# EAGLE design nisetoro_wsc_adapter_v3 (EAGLE 9.6.2)
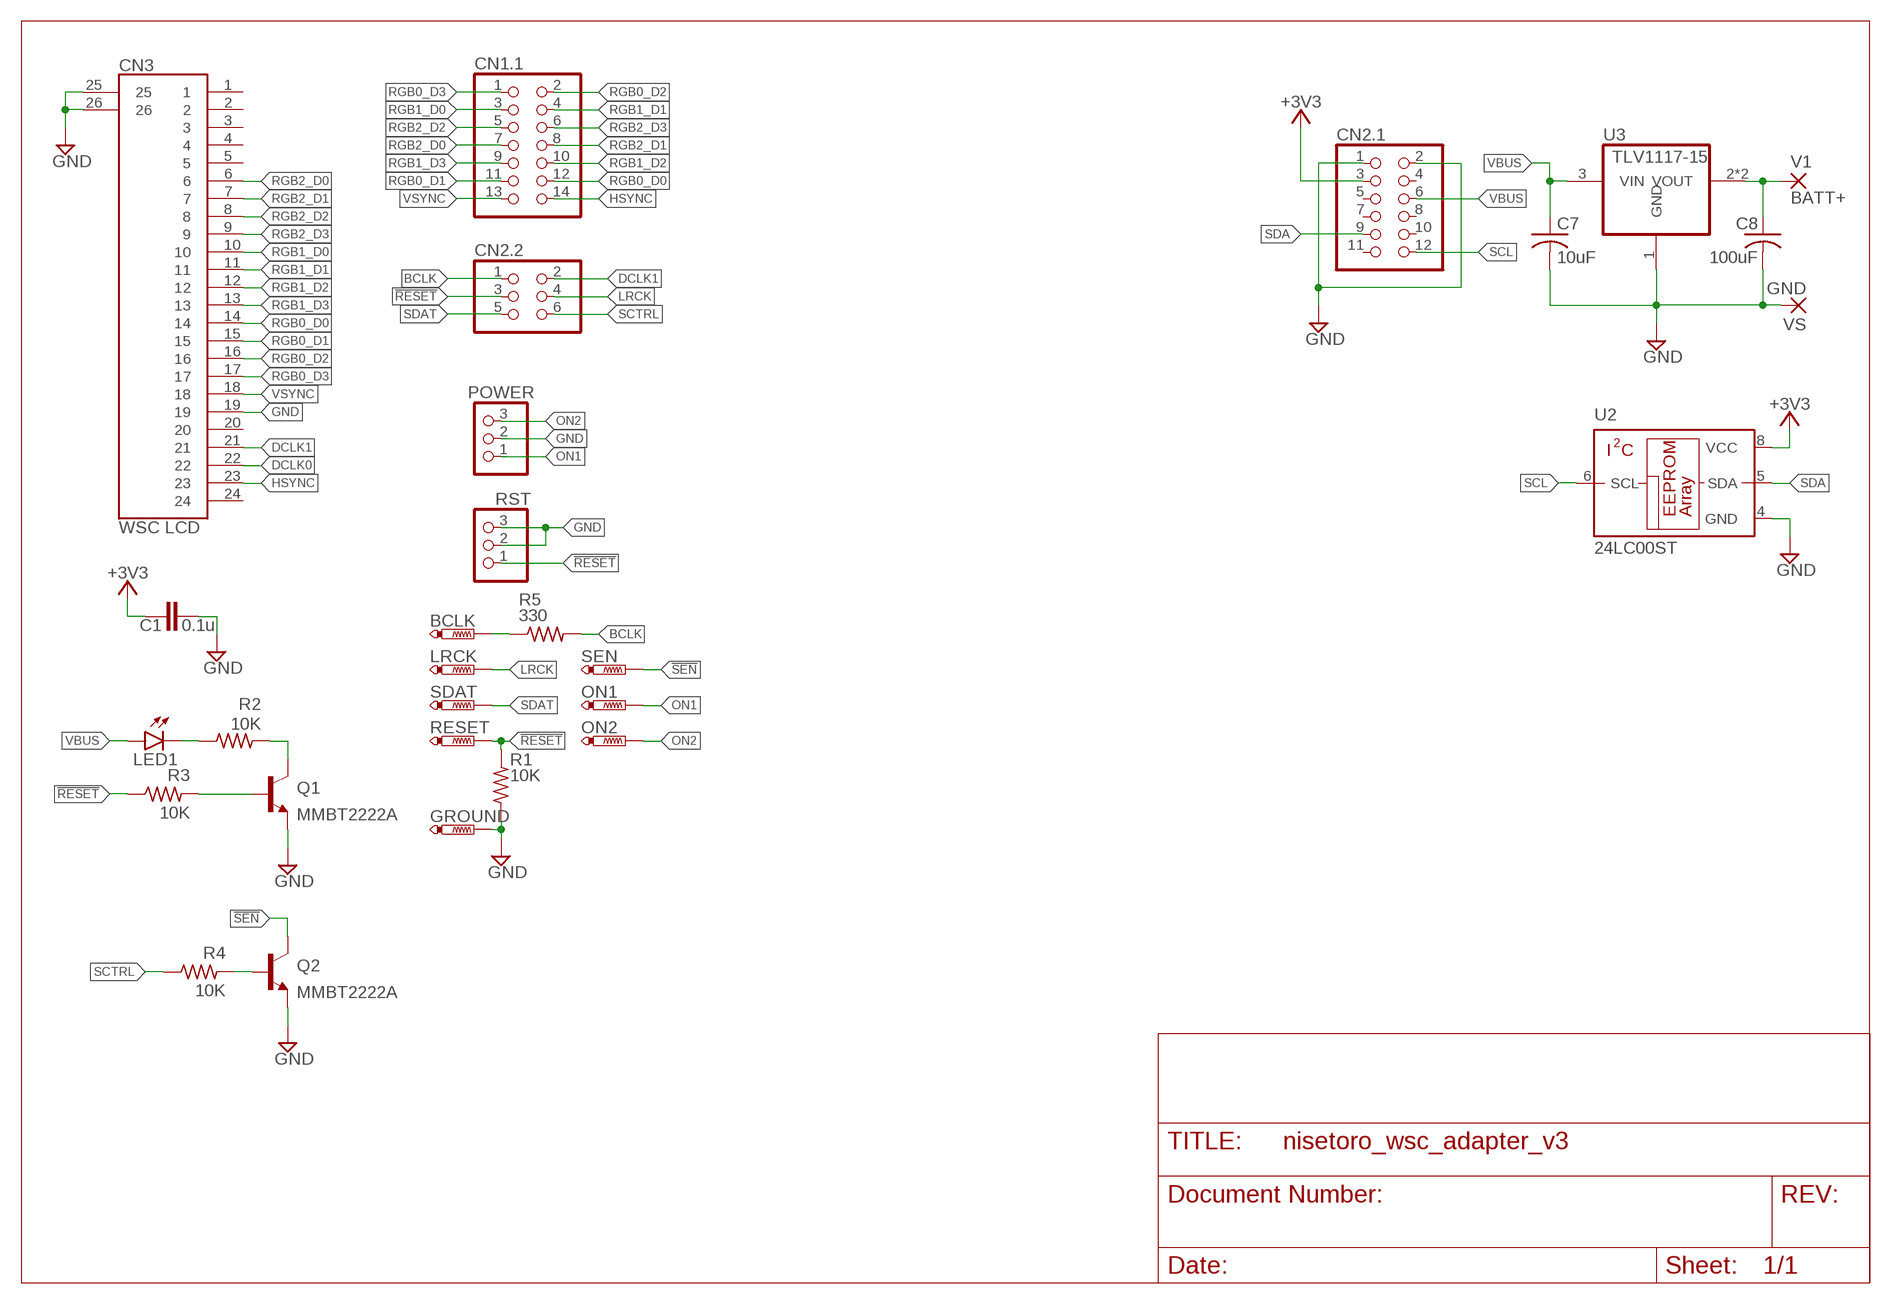
[diagram p0: schematic, sheet 1]

## Parts
BCLK  PTR1B1,27  [B1,27]
C1  0.1u  C-EUC0805  [C0805]
C7  10uF  C-USC1210  [C1210]
C8  100uF  C-USC1210  [C1210]
CN1.1  PINHD-2X7  [2X07]
CN2.1  PINHD-2X6  [2X06]
CN2.2  PINHD-2X3  [2X03]
CN3  WSC LCD  68712414022/R  [68712414022/R]
GROUND  PTR1B1,27  [B1,27]
LED1  LEDSML0603  [SML0603]
LRCK  PTR1B1,27  [B1,27]
ON1  PTR1B1,27  [B1,27]
ON2  PTR1B1,27  [B1,27]
POWER  PINHD-1X3/ROUND  [1X03/ROUND]
Q1  MMBT2222A  2N2222SOT23  [SOT23-BEC]
Q2  MMBT2222A  2N2222SOT23  [SOT23-BEC]
R1  10K  R-US_R0805  [R0805]
R2  10K  R-US_R0805  [R0805]
R3  10K  R-US_R0805  [R0805]
R4  10K  R-US_R0805  [R0805]
R5  330  R-US_R0805  [R0805]
RESET  PTR1B1,27  [B1,27]
RST  PINHD-1X3/ROUND  [1X03/ROUND]
SDAT  PTR1B1,27  [B1,27]
SEN  PTR1B1,27  [B1,27]
U2  24LC00ST  [TSSOP8]
U3  TLV1117-15  REG1117  [SOT223]
V1  BATT+  WIREPADSMD2,54-5,08  [SMD2,54-5,08]
VS  GND  WIREPADSMD2,54-5,08  [SMD2,54-5,08]

## Nets
!RESET: CN2.2.3 R1.2 R3.1 RESET.TP RST.1
!SEN: Q2.C SEN.TP
+3V3: C1.1 CN2.1.3 U2.8(VCC)
BATT+: C8.1 U3.2(VOUT) U3.4(VOUT) V1.1(P)
BCLK: CN2.2.1 R5.2
DCLK0: CN3.22
DCLK1: CN2.2.2 CN3.21
GND: C1.2 C7.2 C8.2 CN2.1.1 CN2.1.2 CN3.19 CN3.25 CN3.26 GROUND.TP POWER.2 Q1.E Q2.E R1.1 RST.2 RST.3 U2.4(GND) U3.1(GND) VS.1(P)
HSYNC: CN1.1.14 CN3.23
LRCK: CN2.2.4 LRCK.TP
N$1: LED1.C R2.1
N$2: Q1.C R2.2
N$3: BCLK.TP R5.1
N$4: Q1.B R3.2
N$6: Q2.B R4.2
ON1: ON1.TP POWER.1
ON2: ON2.TP POWER.3
RGB0_D0: CN1.1.12 CN3.14
RGB0_D1: CN1.1.11 CN3.15
RGB0_D2: CN1.1.2 CN3.16
RGB0_D3: CN1.1.1 CN3.17
RGB1_D0: CN1.1.3 CN3.10
RGB1_D1: CN1.1.4 CN3.11
RGB1_D2: CN1.1.10 CN3.12
RGB1_D3: CN1.1.9 CN3.13
RGB2_D0: CN1.1.7 CN3.6
RGB2_D1: CN1.1.8 CN3.7
RGB2_D2: CN1.1.5 CN3.8
RGB2_D3: CN1.1.6 CN3.9
SCL: CN2.1.12 U2.6(SCL)
SCTRL: CN2.2.6 R4.1
SDA: CN2.1.9 U2.5(SDA)
SDAT: CN2.2.5 SDAT.TP
VBUS: C7.1 CN2.1.6 LED1.A U3.3(VIN)
VSYNC: CN1.1.13 CN3.18
Unconnected: CN2.1.4 CN2.1.5 CN2.1.7 CN2.1.8 CN2.1.10 CN2.1.11 CN3.1 CN3.2 CN3.3 CN3.4 CN3.5 CN3.20 CN3.24

## Library data of the parts
BCLK GROUND LRCK ON1 ON2 RESET SDAT SEN = testpad:PTR1: TEST PIN
C1 = rcl:C-EU: CAPACITOR, European symbol; SPICEPREFIX: C
C7 C8 = rcl:C-US: CAPACITOR, American symbol; SPICEPREFIX: C
CN1.1 = pinhead:PINHD-2X7: PIN HEADER
CN2.1 = pinhead:PINHD-2X6: PIN HEADER
CN2.2 = pinhead:PINHD-2X3: PIN HEADER
CN3 = SamacSys_Parts:68712414022: Wurth Elektronik 687 0.5mm Pitch 24 Way Straight SMT FPC Connector Source: Datasheet <http://katalog.we-online.de/em/datasheet/68712414022.pdf>
LED1 = led:LED: LED OSRAM: - CHIPLED LG R971, LG N971, LY N971, LG Q971, LY Q971, LO R971, LY R971 LH N974, LH R974 LS Q976, LO Q976, LY Q976 LO Q996 - Hyper CHIPLED LW Q18S LB Q993, LB Q99A, LB R99A - SideLED LS A670, LO A670, LY A670, LG A670, LP A670 LB A673, LV A673, LT A673, LW A673 LH A674 LY A675 LS A676, LA A676, LO A676, LY A676, LW A676 LS A679, LY A679, LG A679 - Hyper Micro SIDELED® LS Y876, LA Y876, LO Y876, LY Y876 LT Y87S - SmartLED LW L88C, LW L88S LB L89C, LB L89S, LG L890 LS L89K, LO L89K, LY L89K LS L896, LA L896, LO L896, LY L896 - TOPLED LS T670, LO T670, LY T670, LG T670, LP T670 LSG T670, LSP T670, LSY T670, LOP T670, LYG T670 LG T671, LOG T671, LSG T671 LB T673, LV T673, LT T673, LW T673 LH T674 LS T676, LA T676, LO T676, LY T676, LB T676, LH T676, LSB T676, LW T676 LB T67C, LV T67C, LT T67C, LS T67K, LO T67K, LY T67K, LW E67C LS E67B, LA E67B, LO E67B, LY E67B, LB E67C, LV E67C, LT E67C LW T67C LS T679, LY T679, LG T679 LS T770, LO T770, LY T770, LG T770, LP T770 LB T773, LV T773, LT T773, LW T773 LH T774 LS E675, LA E675, LY E675, LS T675 LS T776, LA T776, LO T776, LY T776, LB T776 LHGB T686 LT T68C, LB T68C - Hyper Mini TOPLED® LB M676 - Mini TOPLED Santana® LG M470 LS M47K, LO M47K, LY M47K Source: http://www.osram.convergy.de LUXEON: - LUMILED® LXK2-PW12-R00, LXK2-PW12-S00, LXK2-PW14-U00, LXK2-PW14-V00 LXK2-PM12-R00, LXK2-PM12-S00, LXK2-PM14-U00 LXK2-PE12-Q00, LXK2-PE12-R00, LXK2-PE12-S00, LXK2-PE14-T00, LXK2-PE14-U00 LXK2-PB12-K00, LXK2-PB12-L00, LXK2-PB12-M00, LXK2-PB14-N00, LXK2-PB14-P00, LXK2-PB14-Q00 LXK2-PR12-L00, LXK2-PR12-M00, LXK2-PR14-Q00, LXK2-PR14-R00 LXK2-PD12-Q00, LXK2-PD12-R00, LXK2-PD12-S00 LXK2-PH12-R00, LXK2-PH12-S00 LXK2-PL12-P00, LXK2-PL12-Q00, LXK2-PL12-R00 Source: www.luxeon.com KINGBRIGHT: KA-3528ASYC Source: www.kingbright.com
POWER RST = pinhead:PINHD-1X3: PIN HEADER
Q1 Q2 = transistor-npn:2N2222*: NPN Transistor
R1-R5 = rcl:R-US_: RESISTOR, American symbol; SPICEPREFIX: R
U2 = microchip:24*00: Serial EEPROM 128 bit, I2C (AA = 1.8 V/LC = 2.5 V/C = 5.0 V); MF: MICROCHIP; MPN: 24LC00-I/ST; OC_FARNELL: unknown; OC_NEWARK: 96K4067
U3 = burr-brown:REG1117: 800mA and 1A Low Dropout (LDO) Positive Regulator 1.8V, 2.5V, 2.85V, 3.3V, 5V, and Adj; MPN: REG1117; OC_FARNELL: 1097566; OC_NEWARK: 14P6981
V1 VS = wirepad:WIREPAD: Wire PAD connect wire on PCB

## Board
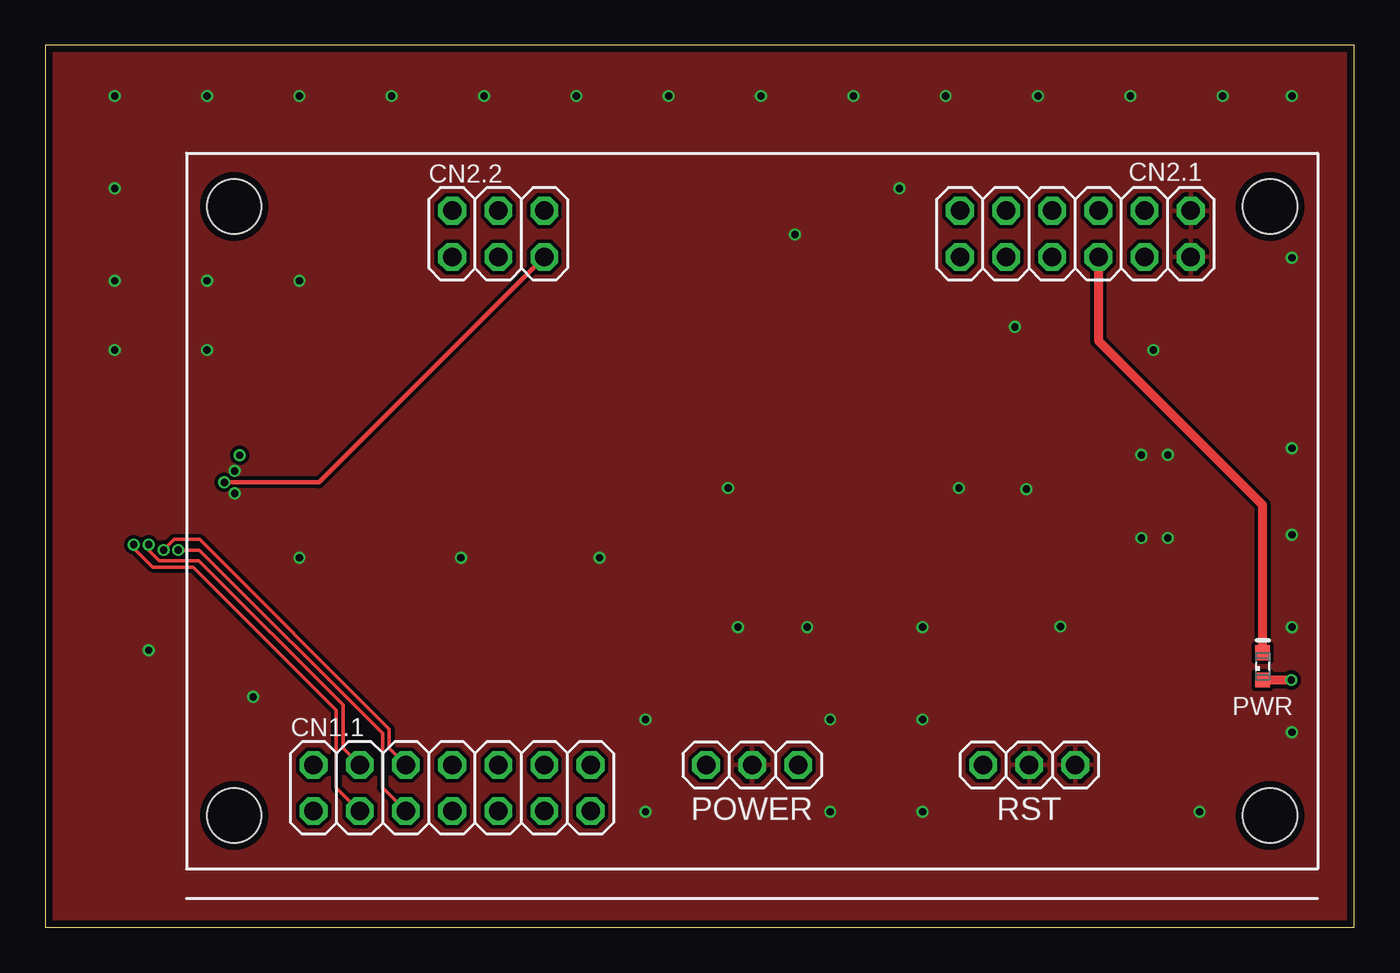
[diagram p1: board, top side]
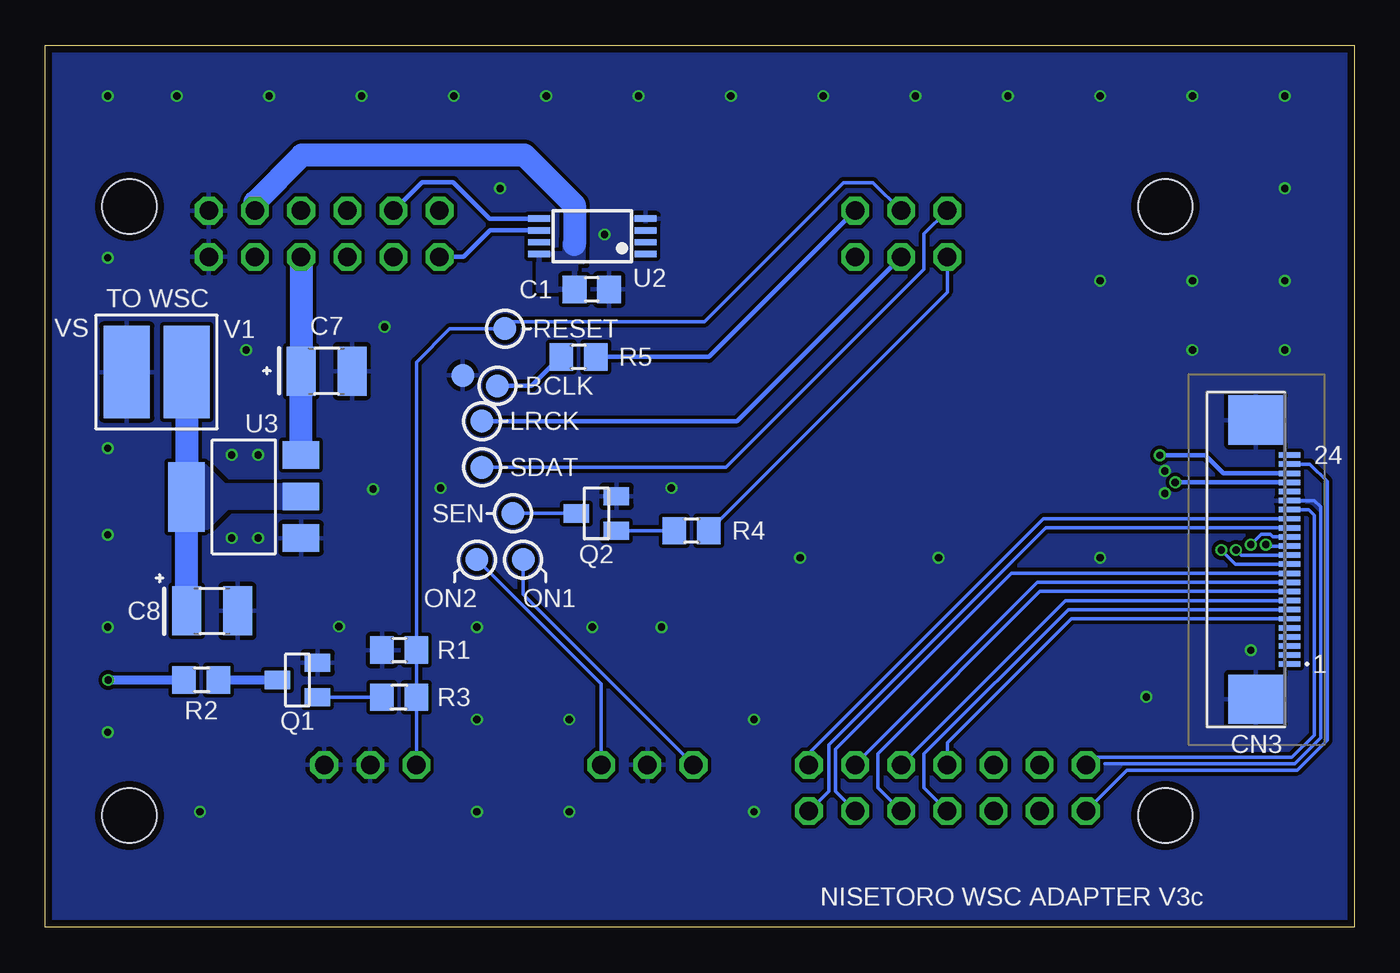
[diagram p2: board, bottom side, seen from below]

Size 72 x 48.5 mm. Coordinates in mm from the lower left corner, seen from the top.
Outline: 0,0 72,0 72,48.5 0,48.5 0,0
Copper layers (1*16): Top 0.035559375mm / dielectric 1.6mm / Bottom 0.035559375mm
Design rules "oshpark-2layer *": minimum track width 6mil, minimum drill 10mil, track to track 6mil, track to pad 6mil, pad to pad 6mil, via to via 6mil, smd to smd 6mil, copper to edge 15mil, drill to drill 6mil, minimum pad ring 5mil, minimum via ring 5mil, stop-mask expansion 2.5mil, vias tented up to drill 15mil, thermal gap 10mil
Holes 3 mm at 10.38,39.65 67.39,39.65 67.39,6.15 10.38,6.15

### Footprints (pad centres in the part's own frame; a part is rotated, then mirrored left to right if it is on the bottom)
B1,27 = smd 1.27 x 1.27: TP 0,0
C0805 = smd 1.3 x 1.5: 1 -0.95,0; 2 0.95,0
C1210 = smd 1.6 x 2.7: 1 -1.4,0; 2 1.4,0
2X07 = drill 1.016 octagon: 1 -7.62,-1.27; 2 -7.62,1.27; 3 -5.08,-1.27; 4 -5.08,1.27; 5 -2.54,-1.27; 6 -2.54,1.27; 7 0,-1.27; 8 0,1.27; 9 2.54,-1.27; 10 2.54,1.27; 11 5.08,-1.27; 12 5.08,1.27; 13 7.62,-1.27; 14 7.62,1.27
2X06 = drill 1.016 octagon: 1 -6.35,-1.27; 2 -6.35,1.27; 3 -3.81,-1.27; 4 -3.81,1.27; 5 -1.27,-1.27; 6 -1.27,1.27; 7 1.27,-1.27; 8 1.27,1.27; 9 3.81,-1.27; 10 3.81,1.27; 11 6.35,-1.27; 12 6.35,1.27
2X03 = drill 1.016 octagon: 1 -2.54,-1.27; 2 -2.54,1.27; 3 0,-1.27; 4 0,1.27; 5 2.54,-1.27; 6 2.54,1.27
68712414022/R = smd 0.3 x 1.2: 1 5.75,1.825; 2 5.25,1.825; 3 4.75,1.825; 4 4.25,1.825; 5 3.75,1.825; 6 3.25,1.825; 7 2.75,1.825; 8 2.25,1.825; 9 1.75,1.825; 10 1.25,1.825; 11 0.75,1.825; 12 0.25,1.825; 13 -0.25,1.825; 14 -0.75,1.825; 15 -1.25,1.825; 16 -1.75,1.825; 17 -2.25,1.825; 18 -2.75,1.825; 19 -3.25,1.825; 20 -3.75,1.825; 21 -4.25,1.825; 22 -4.75,1.825; 23 -5.25,1.825; 24 -5.75,1.825 | smd 2.7 x 3: 25 -7.68,-0.035; 26 7.68,-0.035
SML0603 = smd 0.8 x 0.8: A 0.75,0; C -0.75,0
1X03/ROUND = drill 1.016 octagon: 1 -2.54,0; 2 0,0; 3 2.54,0
SOT23-BEC = smd 1 x 1.4: B -0.95,-1.1; C 0,1.1; E 0.95,-1.1
R0805 = smd 1.3 x 1.5: 1 -0.95,0; 2 0.95,0
TSSOP8 = smd 0.35 x 1.2: 1 -0.975,-2.925; 2 -0.325,-2.925; 3 0.325,-2.925; 4 0.975,-2.925; 5 0.975,2.925; 6 0.325,2.925; 7 -0.325,2.925; 8 -0.975,2.925
SOT223 = smd 1.499 x 2.007: 1 -2.261,-3.15; 2 0.025,-3.15; 3 2.311,-3.15 | smd 3.81 x 2.007: 4 0,3.15
SMD2,54-5,08 = smd 2.54 x 5.08: 1 0,0

### Placement (x,y rotation side)
BCLK  47.13,29.78 0 bottom
C1  41.94,35.08 0 bottom
C7  56.53,30.59 0 bottom
C8  62.83,17.4 0 bottom
CN1.1  22.38,7.66 180 top
CN2.1  56.66,38.14 180 top
CN2.2  24.91,38.14 180 top
CN3  5.38,20.22 270 bottom
GROUND  49.04,30.35 0 bottom
LED1  66.98,14.35 90 top
LRCK  47.99,27.84 0 bottom
ON1  45.72,20.22 0 bottom
ON2  48.26,20.22 0 bottom
POWER  38.88,8.93 0 top
Q1  58.13,13.6 90 bottom
Q2  41.69,22.76 90 bottom
R1  52.53,15.25 0 bottom
R2  63.43,13.6 0 bottom
R3  52.53,12.65 180 bottom
R4  36.45,21.81 180 bottom
R5  42.67,31.37 0 bottom
RESET  46.72,32.92 0 bottom
RST  54.12,8.93 0 top
SDAT  47.99,25.3 0 bottom
SEN  46.28,22.76 0 bottom
U2  41.91,38 90 bottom
U3  61.08,23.67 90 bottom
V1  64.23,30.54 0 bottom
VS  67.53,30.54 0 bottom

### Tracks (layer width: path | path; a pad name or v marks a point on that pad's centre or on a via)
!RESET
  Bottom 0.2: 51.59,31.09 49.75,32.92 RESET.TP 46.34,33.3 35.75,33.3 28.1,40.95 26.46,40.95 CN2.2.3
  Bottom 0.203: RST.1 R3.1 R1.2 51.59,31.09
!SEN
  Bottom 0.2: Q2.C SEN.TP
+3V3
  Bottom 1.27: CN2.1.3 60.48,39.88 57.88,42.48 45.66,42.48 42.89,39.72 42.89,37.56
  pour Bottom: 42.83,35.05 44.86,35.05 44.86,37.05 43.4,37.05 43.4,37.68 42.42,37.68 42.42,36.6 42.83,36.6
BATT+
  Bottom 1.27: C8.1 U3.4 V1.1
  pour Bottom (no thermals): 57.48,23.05 61.98,23.05 63.09,21.93 63.37,21.93 63.37,25.4 63.18,25.4 62.13,24.35 58.78,24.35
BCLK
  Bottom 0.254: CN2.2.1 35.5,31.37 R5.2
DCLK0  (via drill 0.4)
  Bottom 0.254: CN3.22 7.21,24.97 8.19,25.96 v10.69,25.96
DCLK1  (via drill 0.4)
  Top 0.254: CN2.2.2 15.05,24.47 v9.84,24.47
  Bottom 0.254: v9.84,24.47 CN3.21
GND  (via drill 0.4)
  Bottom 0.2: CN3.19 2.18,23.47 1.84,23.13 1.84,10.42 3.27,8.99 13.72,8.99
  other vias: 3.81,31.75 3.81,35.56 3.81,40.64 3.81,45.72 8.89,45.72 13.97,45.72 19.05,45.72 24.13,45.72 29.21,45.72 34.29,45.72 39.37,45.72 44.45,45.72 49.53,45.72 54.61,45.72 59.69,45.72 64.77,45.72 68.58,45.72 8.89,35.56 8.89,31.75 68.58,36.83 68.58,26.35 68.58,21.59 68.58,16.51 68.58,10.73 13.97,35.56 22.86,20.32 33.02,11.43 33.02,6.35 38.1,16.51 48.26,6.35 41.91,16.51 48.26,16.51 48.26,11.43 63.5,6.35 53.34,33.02 61.75,25.98 60.29,21.41 46.99,40.64 60.29,25.98 61.75,21.41 55.85,16.54 53.98,24.1 43.18,11.43 43.18,6.35 50.26,24.16 30.48,20.32 13.97,20.32 11.43,12.67 10.41,25.1 10.41,23.86 41.24,38.1 5.68,15.24 37.56,24.16 60.96,31.75
  pour Top (isolate 0.2, rank 6): -1.27,49.53 73.66,49.53 73.66,-1.27 -1.27,-1.27
  pour Bottom (isolate 0.2, rank 6): -1.27,49.53 73.66,49.53 73.66,-1.27 -1.27,-1.27
HSYNC
  Bottom 0.2: CN1.1.14 12.51,8.64 3.12,8.64 1.49,10.28 1.49,24.53 2.42,25.47 CN3.23
LRCK
  Bottom 0.254: CN2.2.4 33.95,27.84 LRCK.TP
N$1  (via drill 0.4)
  Top 0.508: v68.55,13.6 LED1.C
  Bottom 0.508: R2.1 v68.55,13.6
N$2
  Bottom 0.508: Q1.C R2.2
N$3
  Bottom 0.254: R5.1 43.65,31.37 45.25,29.78 BCLK.TP
N$4
  Bottom 0.2: R3.2 Q1.B
N$6
  Bottom 0.2: R4.2 Q2.B
ON1
  Bottom 0.2: ON1.TP 45.72,18.3 POWER.1
ON2
  Bottom 0.2: POWER.3 41.42,13.38 ON2.TP
RGB0_D0  (via drill 0.4)
  Top 0.2: CN1.1.12 16,7.68 16,11.93 8.13,19.81 5.91,19.81 4.86,20.86 v4.86,21.05
  Bottom 0.2: CN3.14 4.78,20.97 v4.86,21.05
RGB0_D1  (via drill 0.4)
  Top 0.2: CN1.1.11 16.37,9.85 16.37,12.23 8.44,20.16 6.25,20.16 5.68,20.72 v5.68,21.05
  Bottom 0.2: CN3.15 4.46,21.47 4.62,21.62 5.1,21.62 v5.68,21.05
RGB0_D2
  Bottom 0.2: CN1.1.2 28.89,7.49 28.89,10.04 16.96,21.98 CN3.16
RGB0_D3
  Bottom 0.2: CN3.17 17.09,22.47 30,9.56 CN1.1.1
RGB1_D0
  Bottom 0.2: CN1.1.3 17.41,18.97 CN3.10
RGB1_D1
  Bottom 0.2: CN3.11 18.86,19.47 28.54,9.79 28.54,7.47 CN1.1.4
RGB1_D2  (via drill 0.4)
  Top 0.2: CN1.1.10 18.54,7.68 18.54,10.66 8.46,20.75 v7.31,20.75
  Bottom 0.2: v7.31,20.75 v7.31,20.74 6.54,19.97 CN3.12
RGB1_D3  (via drill 0.4)
  Top 0.2: CN1.1.9 18.91,9.85 18.91,10.89 8.48,21.33 7.07,21.33 v6.5,20.76 v6.5,20.75
  Bottom 0.2: v6.5,20.75 6.22,20.47 CN3.13
RGB2_D0
  Bottom 0.2: CN3.6 15.54,16.97 22.38,10.14 CN1.1.7
RGB2_D1
  Bottom 0.2: CN3.7 15.72,17.47 23.65,9.53 23.65,7.67 CN1.1.8
RGB2_D2
  Bottom 0.2: CN3.8 15.88,17.97 CN1.1.5
RGB2_D3
  Bottom 0.2: CN3.9 17.28,18.47 26.19,9.55 26.19,7.67 CN1.1.6
SCL
  Bottom 0.254: U2.6 47.53,38.33 48.98,36.87 CN2.1.12
SCTRL
  Bottom 0.2: CN2.2.6 22.38,34.93 R4.1
SDA
  Bottom 0.254: U2.5 47.55,38.98 49.56,40.98 51.28,40.98 CN2.1.9
SDAT
  Bottom 0.2: CN2.2.5 23.65,38.13 23.65,36.19 34.54,25.3 SDAT.TP
VBUS
  Top 0.508: LED1.A 66.98,23.23 57.94,32.27 CN2.1.6
  Bottom 1.27: CN2.1.6 C7.1 U3.3
VSYNC
  Bottom 0.2: CN3.18 2.5,22.97 2.19,22.66 2.19,10.57 3.42,9.34 14.34,9.34 CN1.1.13

### Text on the board
tPlace: PWR
bPlace: TO WSC | 24 | 1 | NISETORO WSC ADAPTER V3c
bStop: Designed by splash5